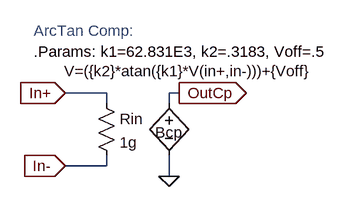
[diagram p0: schematic Comp_At.asc]
Comp_At.asc, the LTspice schematic file:
Version 4
SHEET 1 880 680
WIRE -32 192 -96 192
WIRE -32 208 -32 192
WIRE -32 304 -96 304
WIRE -32 304 -32 288
WIRE 64 208 64 192
WIRE 64 320 64 288
WIRE 80 192 64 192
FLAG -96 192 In+
IOPIN -96 192 In
FLAG -96 304 In-
IOPIN -96 304 In
FLAG 80 192 OutCp
IOPIN 80 192 Out
FLAG 64 320 0
SYMBOL bv 64 192 R0
WINDOW 0 -21 61 Left 0
WINDOW 3 -161 -34 Left 0
SYMATTR InstName Bcp
SYMATTR Value V=({k2}*atan({k1}*V(in+,in-)))+{Voff}
SYMBOL res -48 192 R0
SYMATTR InstName Rin
SYMATTR Value 1g
TEXT -144 128 Left 0 !.Params: k1=62.831E3, k2=.3183, Voff=.5
TEXT -144 96 Left 0 ;ArcTan Comp:

The netlist it stands for:
* Comp_At.asc
Bcp OutCp 0 V=({k2}*atan({k1}*V(in+,in-)))+{Voff}
Rin In+ In- 1g
.Params: k1=62.831E3, k2=.3183, Voff=.5
* ArcTan Comp:
.backanno
.end